# EAGLE schematic FSAE_CONTROLLER (EAGLE 9.3.0)
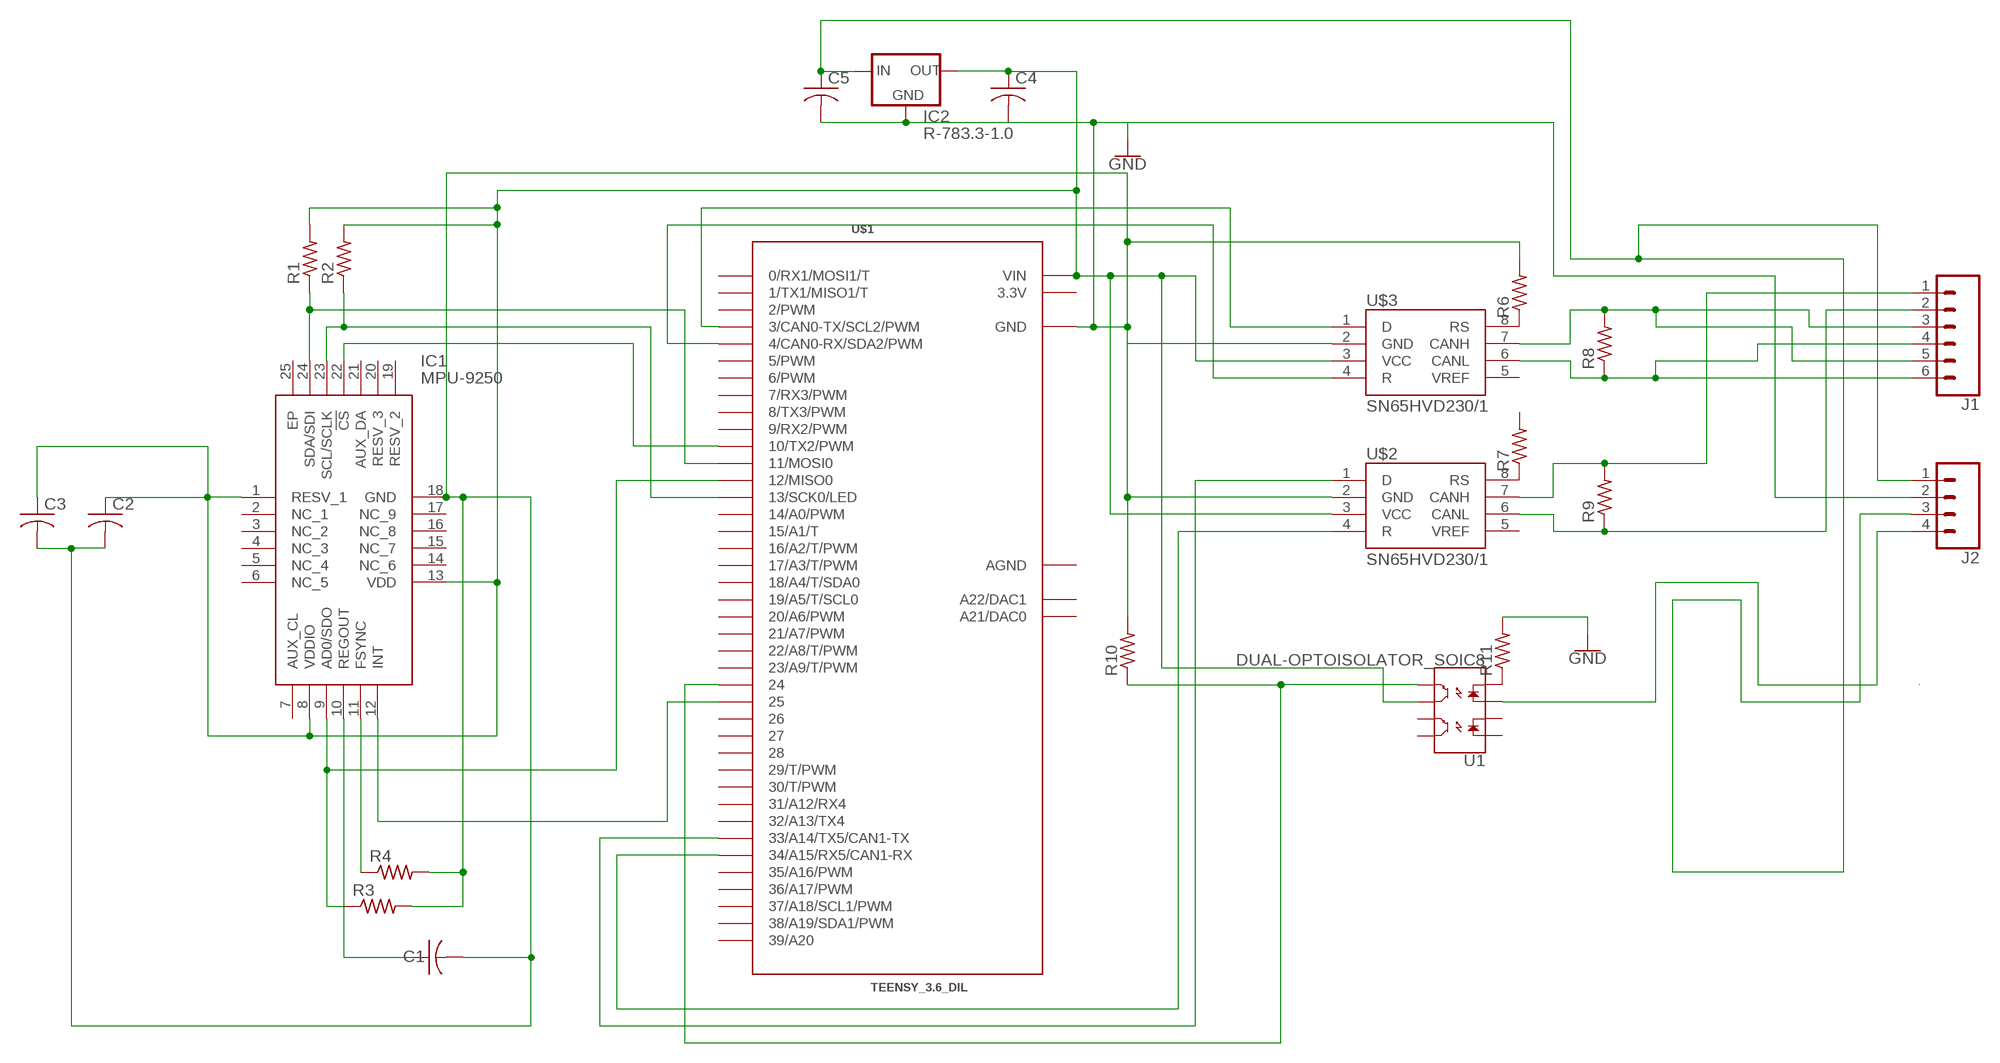
[diagram p0: schematic, sheet 1]

## Parts
C1  C-USC1206  [C1206]
C2  C-USC1206  [C1206]
C3  C-USC1206  [C1206]
C4  C-USC1206  [C1206]
C5  C-USC1206  [C1206]
IC1  MPU-9250  [QFN40P300X300X105-25N]
IC2  R-783.3-1.0  [SIP3]
J1  CONN_063.5MM-6  [SCREWTERMINAL-3.5MM-6]
J2  CONN_04SCREW  [SCREWTERMINAL-3.5MM-4]
R1  R-US_R1206  [R1206]
R2  R-US_R1206  [R1206]
R3  R-US_R1206  [R1206]
R4  R-US_R1206  [R1206]
R6  R-US_R1206  [R1206]
R7  R-US_R1206  [R1206]
R8  R-US_R1206  [R1206]
R9  R-US_R1206  [R1206]
R10  R-US_R1206  [R1206]
R11  R-US_R1206  [R1206]
U1  DUAL-OPTOISOLATOR_SOIC8  [SO08]
U$1  TEENSY_3.6_DIL  [TEENSY_3.6_DIL]
U$2  SN65HVD230/1  [SO8]
U$3  SN65HVD230/1  [SO8]

## Nets
GND: C1.2 C2.2 C3.2 C4.2 C5.2 IC1.18(GND) IC2.2(GND) J2.2 R3.2 R4.2 R6.2 R10.2 R11.2 U$1.GND U$1.GND1(GND) U$2.2(GND) U$3.2(GND)
N$1: J2.3
N$3: IC1.11(FSYNC) R4.1
N$4: C1.1 IC1.10(REGOUT)
N$5: IC1.23(SCL/SCLK) R2.1 U$1.13(13/SCK0/LED)
N$6: IC1.24(SDA/SDI) R1.1 U$1.11(11/MOSI0)
N$7: IC1.9(AD0/SDO) R3.1 U$1.12(12/MISO0)
N$8: IC1.12(INT) U$1.25
N$9: IC1.22(!CS) U$1.10(10/TX2/PWM)
N$10: R6.1 U$3.8(RS)
N$11: R7.1 U$2.8(RS)
N$12: U$1.3(3/CAN0-TX/SCL2/PWM) U$3.1(D)
N$13: U$1.4(4/CAN0-RX/SDA2/PWM) U$3.4(R)
N$14: J1.1 R9.2 U$2.7(CANH)
N$15: J1.3 J1.5 R8.2 U$3.7(CANH)
N$16: J1.4 J1.6 R8.1 U$3.6(CANL)
N$17: J1.2 R9.1 U$2.6(CANL)
N$18: U$1.33/A14(33/A14/TX5/CAN1-TX) U$2.1(D)
N$19: U$1.34/A15(34/A15/RX5/CAN1-RX) U$2.4(R)
N$20: C5.1 IC2.1(IN) J2.1
N$21: R10.1 U1.5(EM2) U$1.24
N$22: R11.1 U1.4(C2)
N$24: J2.4 U1.3(A2)
N$25: C2.1 C3.1 C4.1 IC1.1(RESV_1) IC1.8(VDDIO) IC1.13(VDD) IC2.3(OUT) R1.2 R2.2 U1.6(CL2) U$1.VIN U$2.3(VCC) U$3.3(VCC)
Unconnected: IC1.2(NC_1) IC1.3(NC_2) IC1.4(NC_3) IC1.5(NC_4) IC1.6(NC_5) IC1.7(AUX_CL) IC1.14(NC_6) IC1.15(NC_7) IC1.16(NC_8) IC1.17(NC_9) IC1.19(RESV_2) IC1.20(RESV_3) IC1.21(AUX_DA) IC1.25(EP) R7.2 U1.1(A1) U1.2(C1) U1.7(EM1) U1.8(CL1) U$1.0(0/RX1/MOSI1/T) U$1.1(1/TX1/MISO1/T) U$1.2(2/PWM) U$1.5(5/PWM) U$1.6(6/PWM) U$1.7(7/RX3/PWM) U$1.8(8/TX3/PWM) U$1.9(9/RX2/PWM) U$1.14/A0(14/A0/PWM) U$1.15/A1(15/A1/T) U$1.16/A2(16/A2/T/PWM) U$1.17/A3(17/A3/T/PWM) U$1.18/A4(18/A4/T/SDA0) U$1.19/A5(19/A5/T/SCL0) U$1.20/A6(20/A6/PWM) U$1.21/A7(21/A7/PWM) U$1.22/A8(22/A8/T/PWM) U$1.23/A9(23/A9/T/PWM) U$1.26 U$1.27 U$1.28 U$1.29(29/T/PWM) U$1.30(30/T/PWM) U$1.31/A12(31/A12/RX4) U$1.32/A13(32/A13/TX4) U$1.35/A16(35/A16/PWM) U$1.36/A17(36/A17/PWM) U$1.37/A18(37/A18/SCL1/PWM) U$1.38/A19(38/A19/SDA1/PWM) U$1.39/A20 U$1.A21(A21/DAC0) U$1.A22(A22/DAC1) U$2.5(VREF) U$3.5(VREF)

## Power pins joined to a net without a drawn wire
3.3V: U$1.3.3V U$1.3.3V3(3.3V)
AGND: U$1.AGND

## Library data of the parts
C1-C5 = rcl:C-US: CAPACITOR, American symbol; SPICEPREFIX: C
IC1 = Modded Devices:MPU-9250: Multiple Function Sensor Modules Nine-Axis (Gyro + Accelerometer + Compass) MEMS MotionTracking Device Source: Datasheet <https://store.invensense.com/datasheets/invensense/MPU9250REV1.0.pdf>; DESCRIPTION: Multiple Function Sensor Modules Nine-Axis (Gyro + Accelerometer + Compass) MEMS MotionTracking Device; HEIGHT: 1.05mm; MANUFACTURER_NAME: InvenSense Inc.; MANUFACTURER_PART_NUMBER: MPU-9250; MOUSER_PART_NUMBER: 410-MPU-9250; MOUSER_PRICE-STOCK: https://www.mouser.com/Search/Refine.aspx?Keyword=410-MPU-9250; RS_PART_NUMBER: 1774858; RS_PRICE-STOCK: http://uk.rs-online.com/web/p/products/1774858
IC2 = r-78xx_10:R-78*-1.0: Innoline R-78xx-1.0 Series Switching Regulators - 1.0A, Standard Source: http://www.recom-international.com/pdf/Innoline/R-78xx-1.0.pdf; MF: Recom; MPN: R-783.3-1.0; OC_FARNELL: 1793141; OC_NEWARK: 62X9540
J1 = SparkFun-Connectors:CONN_06: Multi connection point. Often used as Generic Header-pin footprint for 0.1 inch spaced/style header connections On any of the 0.1 inch spaced packages, you can populate with these: Break Away Headers - Straight <https://www.sparkfun.com/products/116> (PRT-00116) Break Away Male Headers - Right Angle <https://www.sparkfun.com/products/553> (PRT-00553) Female Headers <https://www.sparkfun.com/products/115> (PRT-00115) Break Away Headers - Machine Pin <https://www.sparkfun.com/products/117> (PRT-00117) Break Away Female Headers - Swiss Machine Pin <https://www.sparkfun.com/products/743> (PRT-00743) Arduino Stackable Header - 6 Pin <https://www.sparkfun.com/products/9280> (PRT-09280) For SCREWTERMINALS and SPRING TERMINALS visit here: Screw Terimnals on SparkFun.com <https://www.sparkfun.com/search/results?term=Screw+Terminals> (5mm/3.5mm/2.54mm spacing) This device is also useful as a general connection point to wire up your design to another part of your project. Our various solder wires solder well into these plated through hole pads. Hook-Up Wire - Assortment (Stranded, 22 AWG) <https://www.sparkfun.com/products/11375> (PRT-11375) Hook-Up Wire - Assortment (Solid Core, 22 AWG) <https://www.sparkfun.com/products/11367> (PRT-11367) View the entire wire category on our website here <https://www.sparkfun.com/categories/141>
J2 = SparkFun-Connectors:CONN_04: Multi connection point. Often used as Generic Header-pin footprint for 0.1 inch spaced/style header connections On any of the 0.1 inch spaced packages, you can populate with these: Break Away Headers - Straight <https://www.sparkfun.com/products/116> (PRT-00116) Break Away Male Headers - Right Angle <https://www.sparkfun.com/products/553> (PRT-00553) Female Headers <https://www.sparkfun.com/products/115> (PRT-00115) Break Away Headers - Machine Pin <https://www.sparkfun.com/products/117> (PRT-00117) Break Away Female Headers - Swiss Machine Pin <https://www.sparkfun.com/products/743> (PRT-00743) For SCREWTERMINALS and SPRING TERMINALS visit here: Screw Terimnals on SparkFun.com <https://www.sparkfun.com/search/results?term=Screw+Terminals> (5mm/3.5mm/2.54mm spacing) This device is also useful as a general connection point to wire up your design to another part of your project. Our various solder wires solder well into these plated through hole pads. Hook-Up Wire - Assortment (Stranded, 22 AWG) <https://www.sparkfun.com/products/11375> (PRT-11375) Hook-Up Wire - Assortment (Solid Core, 22 AWG) <https://www.sparkfun.com/products/11367> (PRT-11367) View the entire wire category on our website here <https://www.sparkfun.com/categories/141> Special notes: Molex polarized connector foot print use with SKU : PRT-08231 with associated crimp pins and housings. 1MM SMD Version SKU: PRT-10208; PROD_ID: 2xCONN-08399; SF_ID: 2xPRT-08084
R1-R4 R6-R11 = rcl:R-US_: RESISTOR, American symbol; SPICEPREFIX: R
U1 = SparkFun-DiscreteSemi:DUAL-OPTOISOLATOR: Optocoupler, Phototransistor Output, Dual Channel Optically coupled pairs with a gallium arsenide infrared LED and a silicon NPN phototransistor. Signal information, including a DC level, can be transmitted by the device while maintaining a high degree of electrical isolation between input and output. Datasheet <https://www.sparkfun.com/datasheets/Components/SMD/ild205t.pdf> SparkFun Products: SparkFun Opto-isolator Breakout <https://www.sparkfun.com/products/9118>; PROD_ID: IC-09076
U$1 = Teensy_3_and_LC_Series_Boards_v1.4:TEENSY_3.6_DIL: Teensy 3.6 DIL Package
U$2 U$3 = texas_instruments:SN65HVD230/1